# Altium project AwV3S_DevBrd.PrjPcb
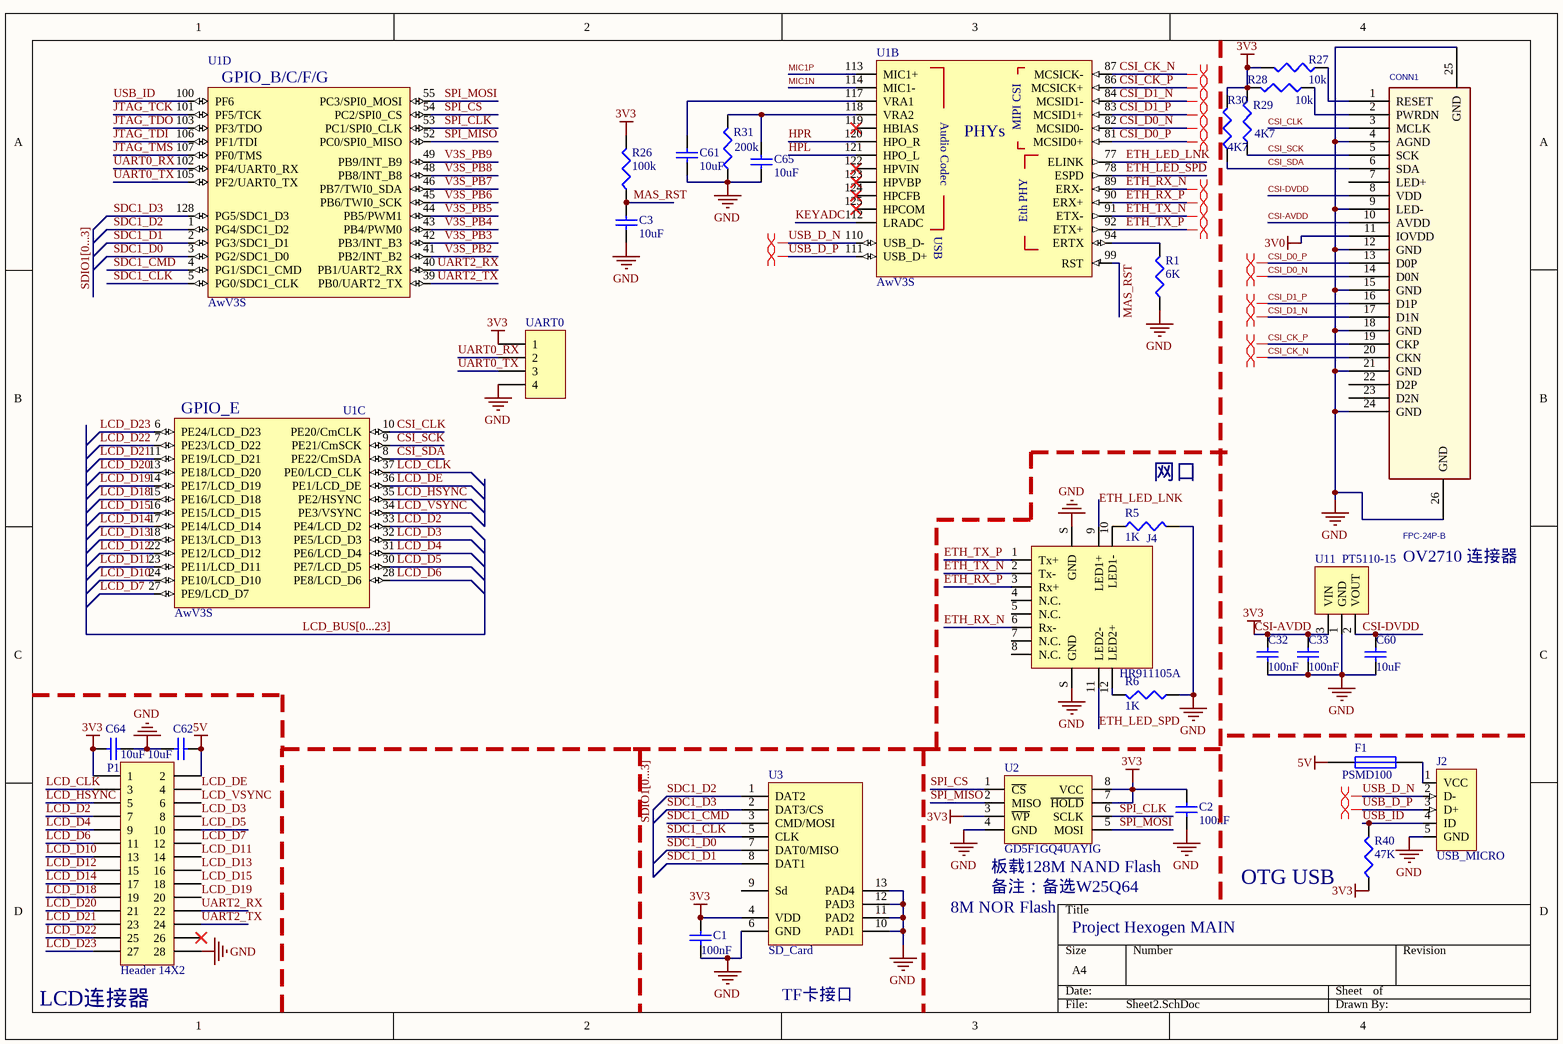
[diagram p0: Sheet2.SchDoc]
3 sheets, 135 parts. Net scope: global (net labels, ports and power ports of the same name join across sheets).
Board file: PCB2.PcbDoc
Sheets:
  Sheet2.SchDoc
  Pwr.SchDoc
  GPIO.SchDoc

## Sheet Sheet2.SchDoc
size A4

### Parts
C1  value 100nF  [0603C]  (hidden comment: 104)
C2  value 100nF  [0603C]  (hidden comment: 104)
C3  value 10uF  [0603C]  (hidden comment: 106)
C32  value 100nF  [0603C]  (hidden comment: 104)
C33  value 100nF  [0603C]  (hidden comment: 104)
C60  value 10uF  [0603C]  (hidden comment: 106)
C61  value 10uF  [0603C]  (hidden comment: 106)
C62  value 10uF  [0603C]  (hidden comment: 106)
C64  value 10uF  [0603C]  (hidden comment: 106)
C65  value 10uF  [0603C]  (hidden comment: 106)
CONN1  FPC-24P-B  [FPC-24P-0.5]
F1  PSMD100  [0805R]
J2  USB_MICRO  [MicroUSB]
J4  HR911105A  [HR911105A]
P1  Header 14X2  [HDR2X14]
R1  6K  [0603R]
R5  1K  [0603R]
R6  1K  [0603R]
R26  100k  [0603R]
R27  10K  [0603R]
R28  10K  [0603R]
R29  4K7  [0603R]
R30  4K7  [0603R]
R31  200K  [0603R]
R40  47K  [0603R]
U1  AwV3S  [ELQFP128E0MM4F7MM8]  (parts B,C,D of 4)
U2  GD5F1GQ4UAYIG  [TSOP8+WSON8-6X5]
U3  SD_Card  [TF_self-eject]
U11  PT5110-15  [SOT-23]
UART0  Header 4  [HDR1X4]  (value not drawn)

### Nets
3V0: CONN1.11(IOVDD)
5V: C62.1 F1.1 P1.2
CSI-AVDD: C1.1 C2.1 C32.2 C33.2 C64.2 CONN1.10(AVDD) P1.1 R26.2 R27.2 R28.2 R29.2 R30.2 R40.1 U1.122(HPVIN) U2.3(~{WP}) U2.7(~{HOLD}) U2.8(VCC) U3.4(VDD) U11.3(VIN) UART0.1  [also labelled 3V3]
GND: C1.2 C2.2 C3.2 C32.1 C33.1 C60.1 C61.2 C62.2 C64.1 C65.2 CONN1.4(AGND) CONN1.9(LED-) CONN1.12(GND) CONN1.15(GND) CONN1.18(GND) CONN1.21(GND) CONN1.24(GND) CONN1.25(GND) CONN1.26(GND) J2.5(GND) J4.S(GND) P1.28 R1.1 R5.2 R6.1 R31.1 U2.4(GND) U3.6(GND) U3.10(PAD1) U3.11(PAD2) U3.12(PAD3) U3.13(PAD4) U11.1(GND) UART0.4
CSI-DVDD: C60.2 CONN1.8(VDD) U11.2(VOUT)
CSI_CK_N: CONN1.20(CKN) U1.87(MCSICK-)
CSI_CK_P: CONN1.19(CKP) U1.86(MCSICK+)
CSI_CLK: CONN1.3(MCLK) U1.10(PE20/CmCLK)
CSI_D0_N: CONN1.14(D0N) U1.82(MCSID0-)
CSI_D0_P: CONN1.13(D0P) U1.81(MCSID0+)
CSI_D1_N: CONN1.17(D1N) U1.84(MCSID1-)
CSI_D1_P: CONN1.16(D1P) U1.83(MCSID1+)
CSI_SCK: CONN1.5(SCK) R29.1 U1.9(PE21/CmSCK)
CSI_SDA: CONN1.6(SDA) R30.1 U1.8(PE22/CmSDA)
ETH_LED_LNK: J4.9(LED1+) U1.77(ELINK)
ETH_LED_SPD: J4.11(LED2-) U1.78(ESPD)
ETH_RX_N: J4.6(Rx-) U1.89(ERX-)
ETH_RX_P: J4.3(Rx+) U1.90(ERX+)
ETH_TX_N: J4.2(Tx-) U1.91(ETX-)
ETH_TX_P: J4.1(Tx+) U1.92(ETX+)
HPL: U1.121(HPO_L)
HPR: U1.120(HPO_R)
JTAG_TCK: U1.101(PF5/TCK)
JTAG_TDI: U1.106(PF1/TDI)
JTAG_TDO: U1.103(PF3/TDO)
JTAG_TMS: U1.107(PF0/TMS)
KEYADC: U1.112(LRADC)
LCD_CLK: P1.3 U1.37(PE0/LCD_CLK)
LCD_D2: P1.7 U1.33(PE4/LCD_D2)
LCD_D3: P1.8 U1.32(PE5/LCD_D3)
LCD_D4: P1.9 U1.31(PE6/LCD_D4)
LCD_D5: P1.10 U1.30(PE7/LCD_D5)
LCD_D6: P1.11 U1.28(PE8/LCD_D6)
LCD_D7: P1.12 U1.27(PE9/LCD_D7)
LCD_D10: P1.13 U1.24(PE10/LCD_D10)
LCD_D11: P1.14 U1.23(PE11/LCD_D11)
LCD_D12: P1.15 U1.22(PE12/LCD_D12)
LCD_D13: P1.16 U1.18(PE13/LCD_D13)
LCD_D14: P1.17 U1.17(PE14/LCD_D14)
LCD_D15: P1.18 U1.16(PE15/LCD_D15)
LCD_D18: P1.19 U1.15(PE16/LCD_D18)
LCD_D19: P1.20 U1.14(PE17/LCD_D19)
LCD_D20: P1.21 U1.13(PE18/LCD_D20)
LCD_D21: P1.23 U1.11(PE19/LCD_D21)
LCD_D22: P1.25 U1.7(PE23/LCD_D22)
LCD_D23: P1.27 U1.6(PE24/LCD_D23)
LCD_DE: P1.4 U1.36(PE1/LCD_DE)
LCD_HSYNC: P1.5 U1.35(PE2/HSYNC)
LCD_VSYNC: P1.6 U1.34(PE3/VSYNC)
MAS_RST: C3.1 R26.1 U1.99(RST)
MIC1N: U1.114(MIC1-)
MIC1P: U1.113(MIC1+)
SDC1_CLK: U1.5(PG0/SDC1_CLK) U3.5(CLK)
SDC1_CMD: U1.4(PG1/SDC1_CMD) U3.3(CMD/MOSI)
SDC1_D0: U1.3(PG2/SDC1_D0) U3.7(DAT0/MISO)
SDC1_D1: U1.2(PG3/SDC1_D1) U3.8(DAT1)
SDC1_D2: U1.1(PG4/SDC1_D2) U3.1(DAT2)
SDC1_D3: U1.128(PG5/SDC1_D3) U3.2(DAT3/CS)
SPI_CLK: U1.53(PC1/SPI0_CLK) U2.6(SCLK)
SPI_CS: U1.54(PC2/SPI0_CS) U2.1(~{CS})
SPI_MISO: U1.52(PC0/SPI0_MISO) U2.2(MISO)
SPI_MOSI: U1.55(PC3/SPI0_MOSI) U2.5(MOSI)
UART0_RX: U1.102(PF4/UART0_RX) UART0.2
UART0_TX: U1.105(PF2/UART0_TX) UART0.3
UART2_RX: P1.22 U1.40(PB1/UART2_RX)
UART2_TX: P1.24 U1.39(PB0/UART2_TX)
USB_D_N: J2.2(D-) U1.110(USB_D-)
USB_D_P: J2.3(D+) U1.111(USB_D+)
USB_ID: J2.4(ID) R40.2 U1.100(PF6)
V3S_PB2: U1.41(PB2/INT_B2)
V3S_PB3: U1.42(PB3/INT_B3)
V3S_PB4: U1.43(PB4/PWM0)
V3S_PB5: U1.44(PB5/PWM1)
V3S_PB6: U1.45(PB6/TWI0_SCK)
V3S_PB7: U1.46(PB7/TWI0_SDA)
V3S_PB8: U1.48(PB8/INT_B8)
V3S_PB9: U1.49(PB9/INT_B9)
NetC61_1: C61.1 U1.117(VRA1)
NetC65_1: C65.1 R31.2 U1.118(VRA2)
NetCONN1_1: CONN1.1(RESET) R27.1
NetCONN1_2: CONN1.2(PWRDN) R28.1
NetF1_2: F1.2 J2.1(VCC)
NetJ4_10: J4.10(LED1-) R5.1
NetJ4_12: J4.12(LED2+) R6.2
NetR1_2: R1.2 U1.94(ERTX)

Not connected (* = marked no-connect by the designer): CONN1 7(LED+) 22(D2P) 23(D2N); J4 4(N.C.) 5(N.C.) 7(N.C.) 8(N.C.); P1 26*; U1 119(HBIAS)* 123(HPVBP)* 124(HPCFB)* 125(HPCOM)*; U3 9(Sd)

### Buses and harness runs
bus LCD_BUS[0...23]
bus SDIO1[0...3]

### Layout directives
differential pair: CSI_CK_N, CSI_CK_P, CSI_D0_N, CSI_D0_P, CSI_D1_N, CSI_D1_P, ETH_RX_N, ETH_RX_P, ETH_TX_N, ETH_TX_P, USB_D_N, USB_D_P

### Notes on the sheet
- (near R5) 网口
- OV2710 连接器
- 8M NOR Flash
- (near U2) 板载128M NAND Flash
- (near U2) 备注：备选W25Q64
- Project Hexogen MAIN
- OTG USB
- (near P1) LCD连接器
- TF卡接口
- (in symbol Aw_V3S, part B) Audio Codec; MIPI CSI; PHYs; Eth PHY; USB
- (in symbol Aw_V3S, part C) GPIO_E
- (in symbol Aw_V3S, part D) GPIO_B/C/F/G

### Library data of the parts
C1 C32 C33 C60 C62 C64 = Cap: Capacitor; Published: 8-Jun-2000; LatestRevisionDate: 17-Jul-2002; LatestRevisionNote: Re-released for DXP Platform.; PackageReference: RAD-0.3; Publisher: Altium Limited; PackageDescription: Radial Cap, Thru-Hole; 2 Leads; 0.3 in Pin Spacing
C2 C3 C61 C65 = Cap: 0603 Ceramic Capacitor; Published: 8-Jun-2000; LatestRevisionDate: 17-Jul-2002; LatestRevisionNote: Re-released for DXP Platform.; PackageReference: RAD-0.3; Publisher: Altium Limited; PackageDescription: Radial Cap, Thru-Hole; 2 Leads; 0.3 in Pin Spacing
CONN1 = TD030673_2: FPC Connector 0.4mm Pitch; Page: 10
F1 = Fuse 1: 6V 1A PTC Fuse; Published: 8-Jun-2000; LatestRevisionDate: 17-Jul-2002; LatestRevisionNote: Re-released for DXP Platform.; PackageReference: PIN-W2/E2.8; Publisher: Altium Limited; PackageDescription: Thru-Hole; 2 Leads
J2 = USB_MICRO: OTG USB By V3S
J4 = HR911105A: HanRun 911105A  ETH Jack
P1 = Header 14X2: Header, 14-Pin, Dual row; LatestRevisionDate: 17-Jul-2002; LatestRevisionNote: Re-released for DXP Platform.; Publisher: Altium Limited
R1 R5 R6 R26-R31 R40 = Res3: Resistor; Published: 8-Jun-2000; LatestRevisionDate: 29-May-2009; LatestRevisionNote: IPC-7351 Footprint Added.; PackageReference: J1-0603; Publisher: Altium Limited; PackageDescription: Chip Resistor
  R1: Value: 6K
  R5 R6: Value: 1K
  R26: Value: 100k
  R27 R28: Value: 10k
  R29 R30: Value: 4K7
  R31: Value: 200k
  R40: Value: 47K
U1 = Aw_V3S
U2 = W25Qxx: 128MB NAND Flash WSON8
U11 = PT5110
UART0 = Header 4: Header, 4-Pin; LatestRevisionDate: 17-Jul-2002; LatestRevisionNote: Re-released for DXP Platform.; Publisher: Altium Limited

## Sheet Pwr.SchDoc
size A4
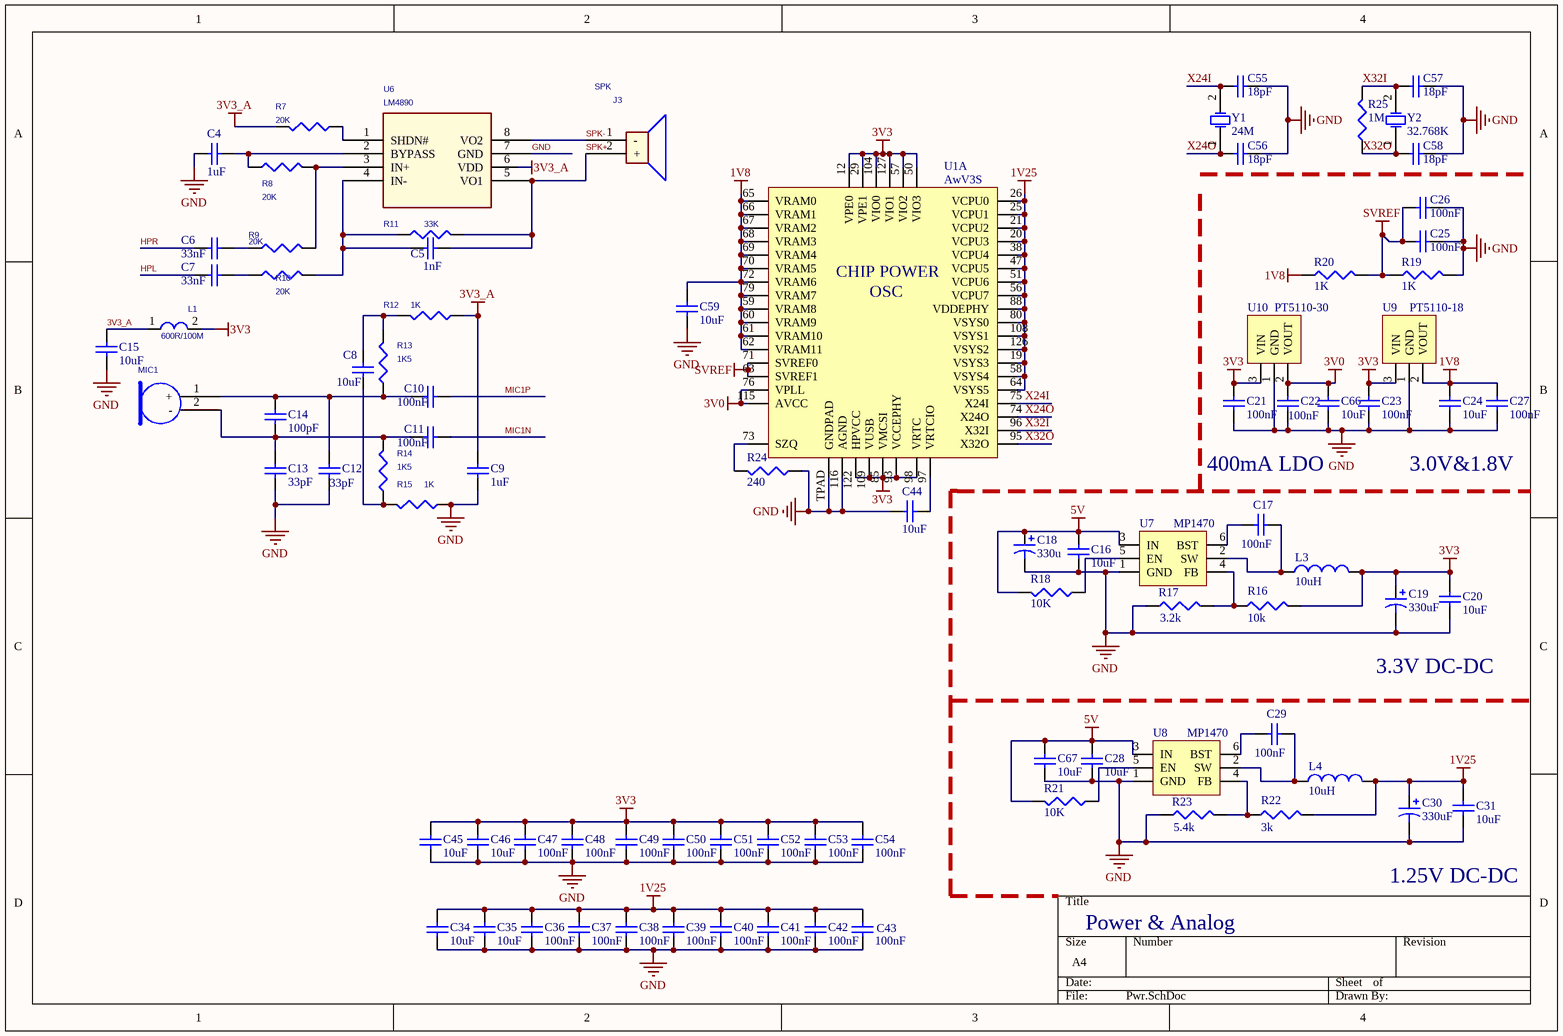
[diagram p1: Pwr.SchDoc]

### Parts
C4  value 1uF  [0603C]  (hidden comment: 105)
C5  value 1nF  [0603C]  (hidden comment: 102)
C6  value 33nF  [0603C]  (hidden comment: 333)
C7  value 33nF  [0603C]  (hidden comment: 333)
C8  value 10uF  [0603C]  (hidden comment: 105)
C9  value 1uF  [0603C]  (hidden comment: 105)
C10  value 100nF  [0603C]  (hidden comment: 104)
C11  value 100nF  [0603C]  (hidden comment: 104)
C12  value 33pF  [0603C]  (hidden comment: 333)
C13  value 33pF  [0603C]  (hidden comment: 333)
C14  value 100pF  [0603C]  (hidden comment: 101)
C15  value 10uF  [0603C]  (hidden comment: Cap)
C16  value 10uF  [0805-0C]  (hidden comment: 106)
C17  value 100nF  [0603C]  (hidden comment: 104)
C18  330u  [TanCap-1210]
C19  value 330uF  [TanCap-1210]  (hidden comment: 330u)
C20  value 10uF  [0805-0C]  (hidden comment: 106)
C21  value 100nF  [0603C]  (hidden comment: 104)
C22  value 100nF  [0603C]  (hidden comment: 104)
C23  value 100nF  [0603C]  (hidden comment: 104)
C24  value 10uF  [0603C]  (hidden comment: 104)
C25  value 100nF  [0603C]  (hidden comment: 104)
C26  value 100nF  [0603C]  (hidden comment: 104)
C27  value 100nF  [0603C]  (hidden comment: 106)
C28  value 10uF  [0805-0C]  (hidden comment: 106)
C29  value 100nF  [0603C]  (hidden comment: 104)
C30  value 330uF  [TanCap-1210]  (hidden comment: 330u)
C31  value 10uF  [0805-0C]  (hidden comment: 106)
C34  value 10uF  [0603C]  (hidden comment: 106)
C35  value 10uF  [0603C]  (hidden comment: 106)
C36  value 100nF  [0603C]  (hidden comment: Cap)
C37  value 100nF  [0603C]  (hidden comment: Cap)
C38  value 100nF  [0603C]  (hidden comment: Cap)
C39  value 100nF  [0603C]  (hidden comment: Cap)
C40  value 100nF  [0603C]  (hidden comment: Cap)
C41  value 100nF  [0603C]  (hidden comment: Cap)
C42  value 100nF  [0603C]  (hidden comment: Cap)
C43  value 100nF  [0603C]  (hidden comment: Cap)
C44  value 10uF  [0603C]  (hidden comment: 106)
C45  value 10uF  [0603C]  (hidden comment: 106)
C46  value 10uF  [0603C]  (hidden comment: 106)
C47  value 100nF  [0603C]  (hidden comment: Cap)
C48  value 100nF  [0603C]  (hidden comment: Cap)
C49  value 100nF  [0603C]  (hidden comment: Cap)
C50  value 100nF  [0603C]  (hidden comment: Cap)
C51  value 100nF  [0603C]  (hidden comment: Cap)
C52  value 100nF  [0603C]  (hidden comment: Cap)
C53  value 100nF  [0603C]  (hidden comment: Cap)
C54  value 100nF  [0603C]  (hidden comment: Cap)
C55  value 18pF  [0603C]  (hidden comment: 18P)
C56  value 18pF  [0603C]  (hidden comment: 18P)
C57  value 18pF  [0603C]  (hidden comment: 33P)
C58  value 18pF  [0603C]  (hidden comment: 33P)
C59  value 10uF  [0603C]  (hidden comment: 106)
C66  value 10uF  [0603C]  (hidden comment: 106)
C67  value 10uF  [0805-0C]  (hidden comment: 106)
J3  SPK  [HDR1X2]
L1  600R/100M  [L0603]
L3  10uH  [PIND0650]
L4  value 10uH  [PIND0650]  (hidden comment: Inductor)
MIC1  Micphone  [mic_4015]  (value not drawn)
R7  20K  [0603R]
R8  20K  [0603R]
R9  20K  [0603R]
R10  20K  [0603R]
R11  33K  [0603R]
R12  1K  [0603R]
R13  1K5  [0603R]
R14  1K5  [0603R]
R15  1K  [0603R]
R16  10K  [0603R]
R17  value 3.2k  [0603R]  (hidden comment: 3K2)
R18  10K  [0603R]
R19  1K  [0603R]
R20  1K  [0603R]
R21  10K  [0603R]
R22  3K  [0603R]
R23  5.4K  [0603R]
R24  240  [0603R]
R25  1M  [0603R]
U1  AwV3S  (part A of 4)
U6  LM4890  [MSOP8]
U7  MP1470  [SOT23-6]
U8  MP1470  [SOT23-6]
U9  PT5110-18  [SOT-23]
U10  PT5110-30  [SOT-23]
Y1  24M  [XTAL-5032]
Y2  32.768K  [XTAL-3215]

### Nets
1V8: C24.2 C27.2 C59.2 R20.1 U1.59(VRAM8) U1.60(VRAM9) U1.61(VRAM10) U1.62(VRAM11) U1.65(VRAM0) U1.66(VRAM1) U1.67(VRAM2) U1.68(VRAM3) U1.69(VRAM4) U1.70(VRAM5) U1.72(VRAM6) U1.79(VRAM7) U9.2(VOUT)
1V25: C30.1 C31.2 C34.2 C35.2 C36.2 C37.2 C38.2 C39.2 C40.2 C41.2 C42.2 C43.2 L4.2 R22.2 U1.19(VSYS3) U1.20(VCPU3) U1.21(VCPU2) U1.25(VCPU1) U1.26(VCPU0) U1.38(VCPU4) U1.47(VCPU5) U1.51(VCPU6) U1.56(VCPU7) U1.58(VSYS4) U1.64(VSYS5) U1.80(VSYS0) U1.88(VDDEPHY) U1.108(VSYS1) U1.126(VSYS2)
3V0: C22.2 C66.1 U1.76(VPLL) U1.115(AVCC) U10.2(VOUT)
3V3: C19.1 C20.2 C21.2 C23.2 C45.2 C46.2 C47.2 C48.2 C49.2 C50.2 C51.2 C52.2 C53.2 C54.2 L1.2 L3.2 R16.2 U1.12(VPE0) U1.29(VPE1) U1.50(VIO3) U1.57(VIO2) U1.85(VMCSI) U1.93(VCCEPHY) U1.98(VRTC) U1.104(VIO0) U1.109(VUSB) U1.122(HPVCC) U1.127(VIO1) U9.3(VIN) U10.3(VIN)  [project net CSI-AVDD]
3V3_A: C9.2 C15.2 L1.1 R7.2 R12.1 U6.6(VDD)
5V: C16.2 C18.1 C28.2 C67.2 R18.2 R21.2 U7.3(IN) U8.3(IN)
GND: C4.2 C9.1 C12.1 C13.1 C15.1 C16.1 C18.2 C19.2 C20.1 C21.1 C22.1 C23.1 C24.1 C25.2 C26.2 C27.1 C28.1 C30.2 C31.1 C34.1 C35.1 C36.1 C37.1 C38.1 C39.1 C40.1 C41.1 C42.1 C43.1 C44.1 C45.1 C46.1 C47.1 C48.1 C49.1 C50.1 C51.1 C52.1 C53.1 C54.1 C55.2 C56.2 C57.2 C58.2 C59.1 C66.2 C67.1 R15.1 R17.1 R19.2 R23.1 R24.1 U1.116(AGND) U1.TPAD(GNDPAD) U6.7(GND) U7.1(GND) U8.1(GND) U9.1(GND) U10.1(GND)
SVREF: C25.1 C26.1 R19.1 R20.2 U1.63(SVREF1) U1.71(SVREF0)
HPL: C7.2
HPR: C6.2
MIC1N: C11.1
MIC1P: C10.1
SPK+: C5.1 J3.2(+) R11.2 U6.5(VO1)
SPK-: J3.1(-) U6.8(VO2)
X24I: C55.1 U1.75(X24I) Y1.2(OSC2)
X24O: C56.1 U1.74(X24O) Y1.1(OSC1)
X32I: C57.1 R25.2 U1.96(X32I) Y2.2(OSC2)
X32O: C58.1 R25.1 U1.95(X32O) Y2.1(OSC1)
NetC4_1: C4.1 R8.1 U6.2(BYPASS)
NetC5_2: C5.2 R10.2 R11.1 U6.4(IN-)
NetC6_1: C6.1 R9.1
NetC7_1: C7.1 R10.1
NetC8_1: C8.1 R14.1 R15.2
NetC8_2: C8.2 R12.2 R13.2
NetC10_2: C10.2 C12.2 C14.2 MIC1.1(+) R13.1
NetC11_2: C11.2 C13.2 C14.1 MIC1.2(-) R14.2
NetC17_1: C17.1 L3.1 U7.2(SW)
NetC17_2: C17.2 U7.6(BST)
NetC29_1: C29.1 L4.1 U8.2(SW)
NetC29_2: C29.2 U8.6(BST)
NetC44_2: C44.2 U1.97(VRTCIO)
NetR7_1: R7.1 U6.1(SHDN#)
NetR8_2: R8.2 R9.2 U6.3(IN+)
NetR16_1: R16.1 R17.2 U7.4(FB)
NetR18_1: R18.1 U7.5(EN)
NetR21_1: R21.1 U8.5(EN)
NetR22_1: R22.1 R23.2 U8.4(FB)
NetR24_2: R24.2 U1.73(SZQ)

### Notes on the sheet
- 400mA LDO
- 3.0V&1.8V
- 3.3V DC-DC
- 1.25V DC-DC
- Power & Analog
- (in symbol Aw_V3S, part A) CHIP POWER; OSC

### Library data of the parts
C4-C15 C25 C26 C34-C58 = Cap: Capacitor; Published: 8-Jun-2000; LatestRevisionDate: 17-Jul-2002; LatestRevisionNote: Re-released for DXP Platform.; PackageReference: RAD-0.3; Publisher: Altium Limited; PackageDescription: Radial Cap, Thru-Hole; 2 Leads; 0.3 in Pin Spacing
C16 C17 C20 C28 C29 C31 C67 = Cap: Ceramic Capacitor 0603; Published: 8-Jun-2000; LatestRevisionDate: 17-Jul-2002; LatestRevisionNote: Re-released for DXP Platform.; PackageReference: RAD-0.3; Publisher: Altium Limited; PackageDescription: Radial Cap, Thru-Hole; 2 Leads; 0.3 in Pin Spacing
C18 C19 C30 = Cap Pol1: Polarized Capacitor (Radial); Published: 8-Jun-2000; LatestRevisionDate: 17-Jul-2002; LatestRevisionNote: Re-released for DXP Platform.; PackageReference: RB7.6-15; Publisher: Altium Limited; PackageDescription: Polarized Capacitor (Radial); 2 Leads
  C18: Value: 330u
C21-C24 C27 C59 = Cap: Ceramic 0603 Capacitor; Published: 8-Jun-2000; LatestRevisionDate: 17-Jul-2002; LatestRevisionNote: Re-released for DXP Platform.; PackageReference: RAD-0.3; Publisher: Altium Limited; PackageDescription: Radial Cap, Thru-Hole; 2 Leads; 0.3 in Pin Spacing
C66 = Cap: 0603 Ceramic Capacitor; Published: 8-Jun-2000; LatestRevisionDate: 17-Jul-2002; LatestRevisionNote: Re-released for DXP Platform.; PackageReference: RAD-0.3; Publisher: Altium Limited; PackageDescription: Radial Cap, Thru-Hole; 2 Leads; 0.3 in Pin Spacing
J3 = SPEAKER
L1 = INDUCTOR_0_Dup1: RoHS BEAD/600ohm 100Mhz Z=600Ω DCR<0.2Ω 800mA SMT L0603; OriginalSymbolOrigin: (10,0); Pin Numbers Visible: TRUE; Pin Names Visible: FALSE; Package: SMT; Pin Names Rotate: TRUE
L3 L4 = Inductor: Inductor 0606; Code_IEC: 1005; Published: 8-Jun-2000; LatestRevisionDate: 29-May-2009; LatestRevisionNote: IPC-7351 Footprint Added.; PackageReference: 0402-A; Publisher: Altium Limited; PackageDescription: Chip Inductor; Code_JEITA: 0402
  L3: Value: 10uH
MIC1 = Micphone_0: mypage: 13
R7-R9 = ?_0: 规格型号: 原材料; 元件类别: 电阻20K,±5%,1/16W,0402 每盘10K; 元件编号: 电阻; Vendor: R0402; 备注: YCL0479
R10 = ?_0: 备注: YCL0479; Vendor: R0402; 元件编号: 电阻; 元件类别: 电阻20K,±5%,1/16W,0402 每盘10K; 规格型号: 原材料
R11 = ?_0: 规格型号: 原材料; 元件类别: 电阻33K,±5%,1/16W,0402 每盘10K; 元件编号: 电阻; Vendor: R0402; 备注: YCL0466
R12-R15 = R_Dup4: mypage: 13
R16-R18 R21-R25 = Res3: Resistor; Published: 8-Jun-2000; LatestRevisionDate: 29-May-2009; LatestRevisionNote: IPC-7351 Footprint Added.; PackageReference: J1-0603; Publisher: Altium Limited; PackageDescription: Chip Resistor
  R16: Value: 10k
  R18 R21: Value: 10K
  R22: Value: 3k
  R23: Value: 5.4k
  R24: Value: 240
  R25: Value: 1M
R19 R20 = Res3: 0603 Resistor; Published: 8-Jun-2000; LatestRevisionDate: 29-May-2009; LatestRevisionNote: IPC-7351 Footprint Added.; PackageReference: J1-0603; Publisher: Altium Limited; PackageDescription: Chip Resistor; Value: 1K
U1 = Aw_V3S
U6 = LY8006_0: 备注: YCL0064; 元件编号: IC; 元件类别: 功放IC4890 / TF690; 规格型号: 原材料; Vendor: MSOP8
U9 U10 = PT5110
Y1 Y2 = XTAL: Crystal Oscillator; Published: 8-Jun-2000; LatestRevisionDate: 17-Jul-2002; LatestRevisionNote: Re-released for DXP Platform.; PackageReference: R38; Publisher: Altium Limited; PackageDescription: Crystal, Thru-Hole; 2 Leads; Body 3.1 x 8.2 mm (Dia.xH)

## Sheet GPIO.SchDoc
size A4
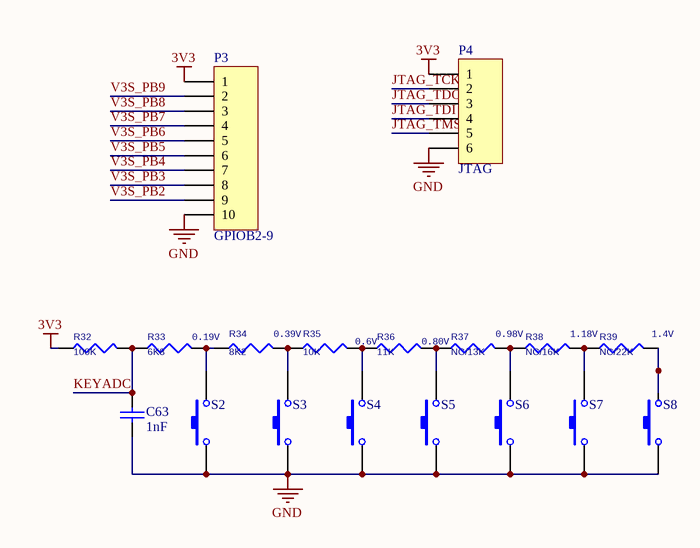
[diagram p2: GPIO.SchDoc]

### Parts
C63  value 1nF  [0603C]  (hidden comment: 103)
P3  GPIOB2-9  [HDR1X10]
P4  JTAG  [HDR1X6]
R32  100K  [0603R]
R33  6K8  [0603R]
R34  8K2  [0603R]
R35  10K  [0603R]
R36  11K  [0603R]
R37  NC/13K  [0603R]
R38  NC/16K  [0603R]
R39  NC/22K  [0603R]
S2  SW-PB  [Switch_SMT-022S-H2.5]  (value not drawn)
S3  SW-PB  [Switch_SMT-022S-H2.5]  (value not drawn)
S4  SW-PB  [Switch_SMT-022S-H2.5]  (value not drawn)
S5  SW-PB  [Switch_SMT-022S-H2.5]  (value not drawn)
S6  SW-PB  [Switch_SMT-022S-H2.5]  (value not drawn)
S7  SW-PB  [Switch_SMT-022S-H2.5]  (value not drawn)
S8  SW-PB  [Switch_SMT-022S-H2.5]  (value not drawn)

### Nets
3V3: P3.1 P4.1 R32.1  [project net CSI-AVDD]
GND: C63.2 P3.10 P4.6 S2.1 S3.1 S4.1 S5.1 S6.1 S7.1 S8.1
JTAG_TCK: P4.2
JTAG_TDI: P4.4
JTAG_TDO: P4.3
JTAG_TMS: P4.5
KEYADC: C63.1 R32.2 R33.1
V3S_PB2: P3.9
V3S_PB3: P3.8
V3S_PB4: P3.7
V3S_PB5: P3.6
V3S_PB6: P3.5
V3S_PB7: P3.4
V3S_PB8: P3.3
V3S_PB9: P3.2
NetR33_2: R33.2 R34.1 S2.2
NetR34_2: R34.2 R35.1 S3.2
NetR35_2: R35.2 R36.1 S4.2
NetR36_2: R36.2 R37.1 S5.2
NetR37_2: R37.2 R38.1 S6.2
NetR38_2: R38.2 R39.1 S7.2
NetR39_2: R39.2 S8.2

### Notes on the sheet
- (near R33) 0.19V
- 0.39V
- 0.98V
- 1.18V
- (near R39) 1.4V
- 0.6V
- (near R36) 0.80V

### Library data of the parts
C63 = Cap: 0603 Ceramic Capacitor; Published: 8-Jun-2000; LatestRevisionDate: 17-Jul-2002; LatestRevisionNote: Re-released for DXP Platform.; PackageReference: RAD-0.3; Publisher: Altium Limited; PackageDescription: Radial Cap, Thru-Hole; 2 Leads; 0.3 in Pin Spacing
P3 = Header 10: Header, 10-Pin; LatestRevisionDate: 17-Jul-2002; LatestRevisionNote: Re-released for DXP Platform.; Publisher: Altium Limited
P4 = Header 6: Header, 6-Pin; LatestRevisionDate: 17-Jul-2002; LatestRevisionNote: Re-released for DXP Platform.; Publisher: Altium Limited
R32-R36 = R1 0805_Dup2: Page: 11
R37-R39 = R1 0805
S2-S8 = SW-PB: Switch; Published: 24-Mar-1999; LatestRevisionDate: 17-Jul-2002; LatestRevisionNote: Re-released for DXP Platform.; PackageReference: SPST-2; Publisher: Altium Limited; PackageDescription: Switch; 2 Leads

## Nets that join several sheets
3V0: Sheet2 (CONN1.11), Pwr (5 pins)
5V: Sheet2 (C62.1 F1.1 P1.2), Pwr (8 pins)
CSI-AVDD: Sheet2 (20 pins), Pwr (30 pins), GPIO (P3.1 P4.1 R32.1)
GND: Sheet2 (34 pins), Pwr (59 pins), GPIO (10 pins)
HPL: Sheet2 (U1.121), Pwr (C7.2)
HPR: Sheet2 (U1.120), Pwr (C6.2)
JTAG_TCK: Sheet2 (U1.101), GPIO (P4.2)
JTAG_TDI: Sheet2 (U1.106), GPIO (P4.4)
JTAG_TDO: Sheet2 (U1.103), GPIO (P4.3)
JTAG_TMS: Sheet2 (U1.107), GPIO (P4.5)
KEYADC: Sheet2 (U1.112), GPIO (C63.1 R32.2 R33.1)
MIC1N: Sheet2 (U1.114), Pwr (C11.1)
MIC1P: Sheet2 (U1.113), Pwr (C10.1)
V3S_PB2: Sheet2 (U1.41), GPIO (P3.9)
V3S_PB3: Sheet2 (U1.42), GPIO (P3.8)
V3S_PB4: Sheet2 (U1.43), GPIO (P3.7)
V3S_PB5: Sheet2 (U1.44), GPIO (P3.6)
V3S_PB6: Sheet2 (U1.45), GPIO (P3.5)
V3S_PB7: Sheet2 (U1.46), GPIO (P3.4)
V3S_PB8: Sheet2 (U1.48), GPIO (P3.3)
V3S_PB9: Sheet2 (U1.49), GPIO (P3.2)